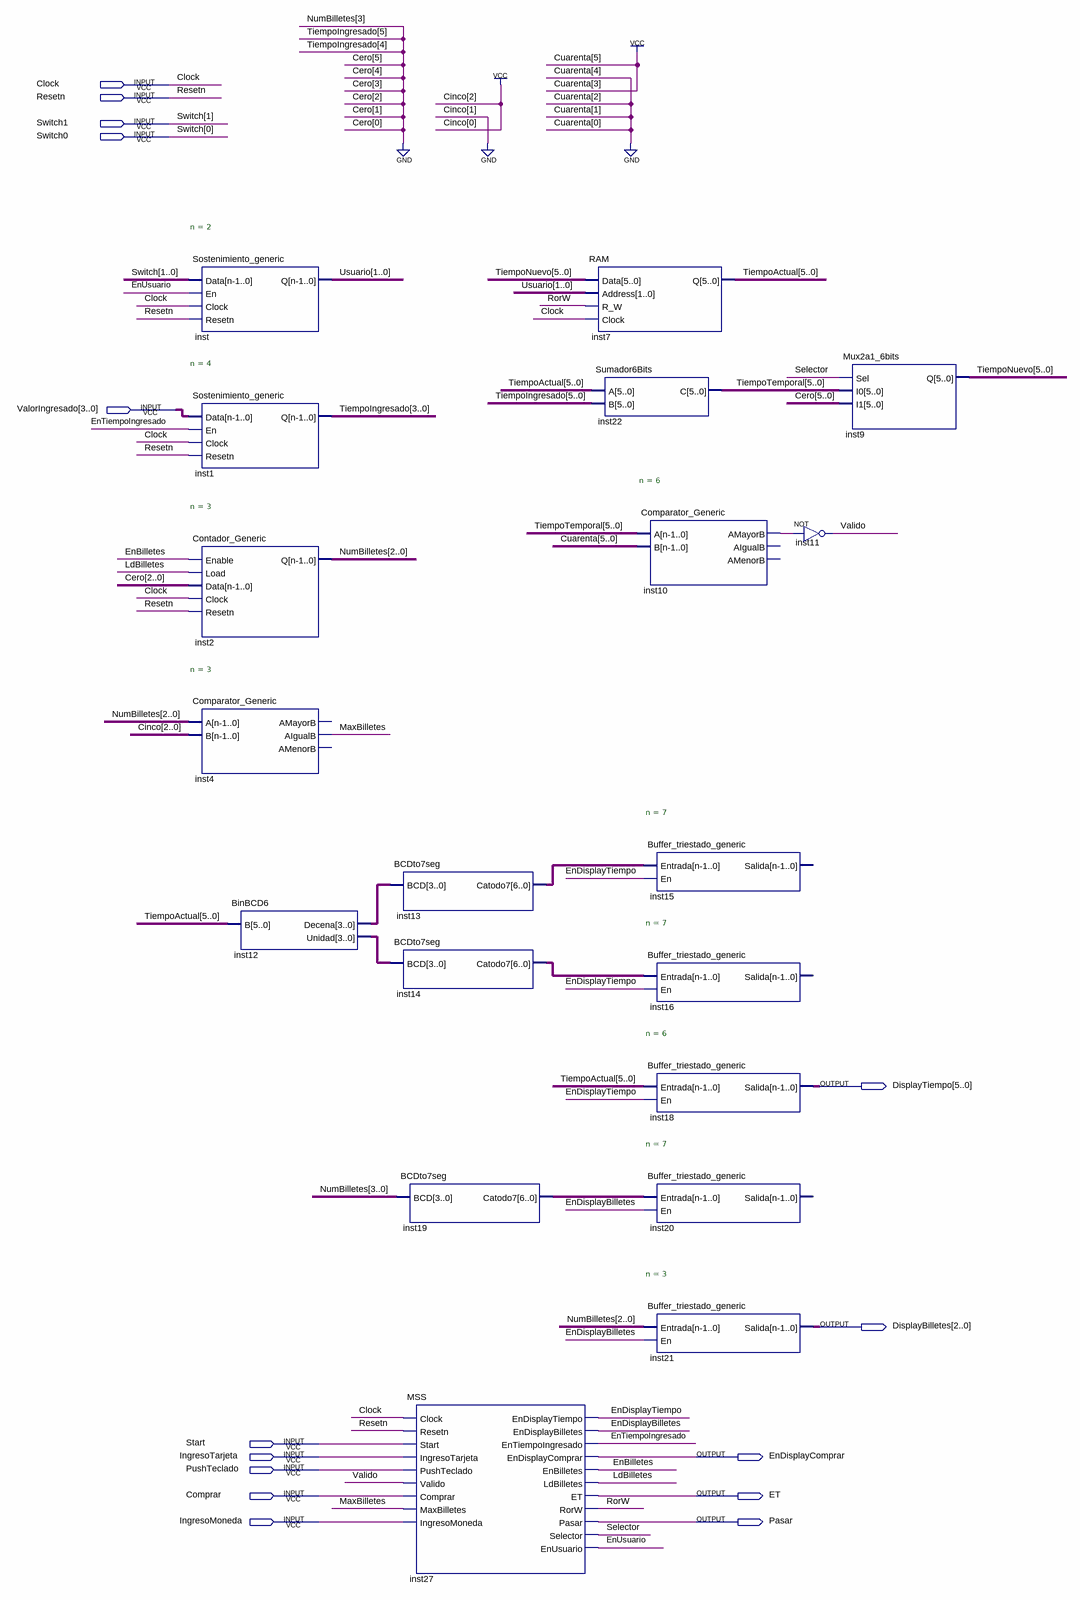
[diagram p0: schematic sheet]
// Quartus schematic Diagrama.bdf as structural Verilog: 19 symbols, 15 pins
module Diagrama (
  input  Clock,
  input  Resetn,
  input  Switch1,
  input  Switch0,
  input  [3:0] ValorIngresado,
  input  Start,
  input  IngresoTarjeta,
  input  PushTeclado,
  input  Comprar,
  input  IngresoMoneda,
  output [5:0] DisplayTiempo,
  output [2:0] DisplayBilletes,
  output EnDisplayComprar,
  output ET,
  output Pasar
);

  wire EnBilletes, EnDisplayBilletes, EnDisplayTiempo, EnTiempoIngresado, EnUsuario, inst10_amayorb,
       LdBilletes, MaxBilletes, RorW, Selector, Valido;
  wire [1:0] Usuario;
  wire [2:0] NumBilletes;
  wire [3:0] inst12_decena, inst12_unidad, TiempoIngresado;
  wire [5:0] TiempoActual, TiempoNuevo, TiempoTemporal;
  wire [6:0] inst13_catodo7, inst14_catodo7, inst19_catodo7;

  Sostenimiento_generic #(.n(2)) inst (
    .Data({Switch1, Switch0}), .En(EnUsuario), .Clock(Clock), .Resetn(Resetn), .Q(Usuario));
  Sostenimiento_generic #(.n(4)) inst1 (
    .Data(ValorIngresado), .En(EnTiempoIngresado), .Clock(Clock), .Resetn(Resetn), .Q(TiempoIngresado));
  Contador_Generic #(.n(3)) inst2 (
    .Enable(EnBilletes), .Load(LdBilletes), .Data(3'b000), .Clock(Clock), .Resetn(Resetn), .Q(NumBilletes));
  Comparator_Generic #(.n(3)) inst4 (.A(NumBilletes), .B(3'b101), .AIgualB(MaxBilletes));  // open: AMayorB, AMenorB
  BinBCD6 inst12 (.B(TiempoActual), .Decena(inst12_decena), .Unidad(inst12_unidad));
  BCDto7seg inst13 (.BCD(inst12_decena), .Catodo7(inst13_catodo7));
  BCDto7seg inst14 (.BCD(inst12_unidad), .Catodo7(inst14_catodo7));
  BCDto7seg inst19 (.BCD({1'b0, NumBilletes}), .Catodo7(inst19_catodo7));
  MSS inst27 (
    .Clock(Clock), .Resetn(Resetn), .Start(Start), .IngresoTarjeta(IngresoTarjeta),
    .PushTeclado(PushTeclado), .Valido(Valido), .Comprar(Comprar), .MaxBilletes(MaxBilletes),
    .IngresoMoneda(IngresoMoneda), .EnDisplayTiempo(EnDisplayTiempo), .EnDisplayBilletes(EnDisplayBilletes),
    .EnTiempoIngresado(EnTiempoIngresado), .EnDisplayComprar(EnDisplayComprar), .EnBilletes(EnBilletes),
    .LdBilletes(LdBilletes), .ET(ET), .RorW(RorW), .Pasar(Pasar), .Selector(Selector), .EnUsuario(EnUsuario));
  RAM inst7 (.Data(TiempoNuevo), .Address(Usuario), .R_W(RorW), .Clock(Clock), .Q(TiempoActual));
  Sumador6Bits inst22 (.A(TiempoActual), .B({2'b00, TiempoIngresado}), .C(TiempoTemporal));
  Comparator_Generic #(.n(6)) inst10 (
    .A(TiempoTemporal), .B(6'b101000), .AMayorB(inst10_amayorb));  // open: AIgualB, AMenorB
  Buffer_triestado_generic #(.n(7)) inst15 (.Entrada(inst13_catodo7), .En(EnDisplayTiempo));  // open: Salida
  Buffer_triestado_generic #(.n(7)) inst16 (.Entrada(inst14_catodo7), .En(EnDisplayTiempo));  // open: Salida
  Buffer_triestado_generic #(.n(6)) inst18 (.Entrada(TiempoActual), .En(EnDisplayTiempo), .Salida(DisplayTiempo));
  Buffer_triestado_generic #(.n(7)) inst20 (.Entrada(inst19_catodo7), .En(EnDisplayBilletes));  // open: Salida
  Buffer_triestado_generic #(.n(3)) inst21 (.Entrada(NumBilletes), .En(EnDisplayBilletes), .Salida(DisplayBilletes));
  not inst11 (Valido, inst10_amayorb);
  Mux2a1_6bits inst9 (.Sel(Selector), .I0(TiempoTemporal), .I1({6{1'b0}}), .Q(TiempoNuevo));
endmodule
